# Altium schematic sheet SD.SchDoc
size A; SheetNumber: 10; SheetTotal: 10
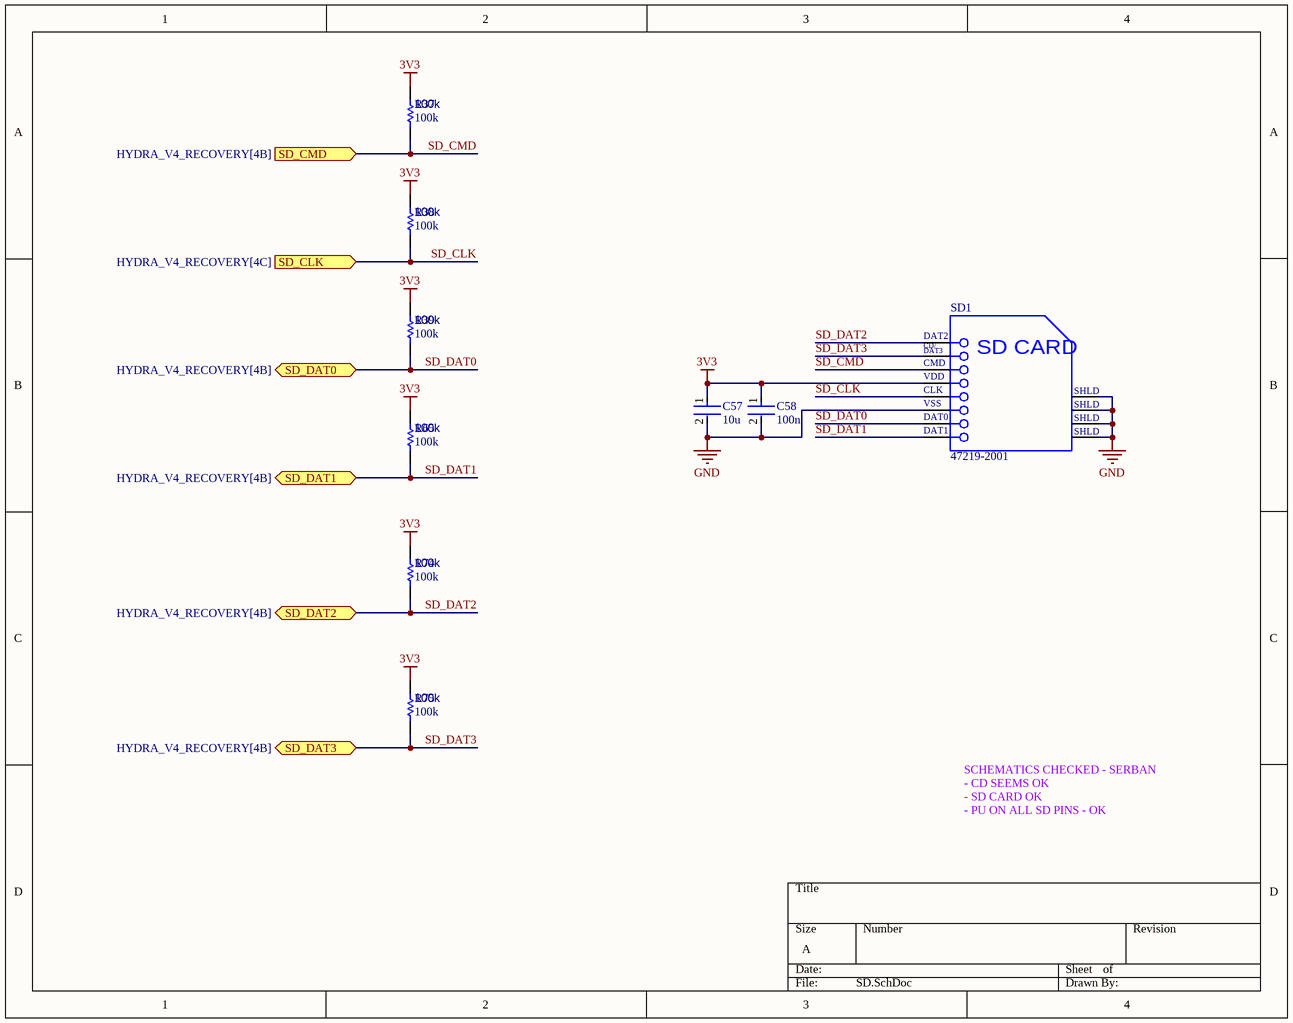
[diagram p0: SD.SchDoc]

## Parts
C57  10u  [FP-0402-L_1_0_0_05-W_0_5-IPC_A]
C58  100n  [FP-0402-L_1_0_0_05-W_0_5-IPC_A]
R37  100k  [R0603B]
R38  100k  [R0603B]
R39  100k  [R0603B]
R65  100k  [R0603B]
R74  100k  [R0603B]
R75  100k  [R0603B]
SD1  47219-2001  [MOLX-47219-2001-8_V]

## Ports
SD_CLK (in, see HYDRA_V4_RECOVERY[4C]), SD_CMD (in, see HYDRA_V4_RECOVERY[4B]), SD_DAT0 (bidir, see HYDRA_V4_RECOVERY[4B]), SD_DAT1 (bidir, see HYDRA_V4_RECOVERY[4B]), SD_DAT2 (bidir, see HYDRA_V4_RECOVERY[4B]), SD_DAT3 (bidir, see HYDRA_V4_RECOVERY[4B])

## Nets
3V3: C57.1 C58.1 R37.1 R38.1 R39.1 R65.1 R74.1 R75.1 SD1.4(VDD)
GND: C57.2 C58.2 SD1.6(VSS) SD1.9(SHLD) SD1.10(SHLD) SD1.11(SHLD) SD1.12(SHLD)
SD_CLK: R38.2 SD1.5(CLK) ; port SD_CLK
SD_CMD: R37.2 SD1.3(CMD) ; port SD_CMD
SD_DAT0: R39.2 SD1.7(DAT0) ; port SD_DAT0
SD_DAT1: R65.2 SD1.8(DAT1) ; port SD_DAT1
SD_DAT2: R74.2 SD1.1(DAT2) ; port SD_DAT2
SD_DAT3: R75.2 SD1.2(CD/DAT3) ; port SD_DAT3

## Notes on the sheet
- SCHEMATICS CHECKED - SERBAN
  - CD SEEMS OK
  - SD CARD OK
  - PU ON ALL SD PINS - OK
- (in symbol CMP-2000-05245-1) CD/; DAT3; SD CARD

## Library data of the parts
C57 C58 = CMP-001-00058-1: LARGE PADS, 0402 CAP, CHANGE COMMENT TO MATCH REAL P/N; Capacitor Type: Ceramic; Min Operating Temperature: -55°C; Mounting Technology: Surface Mount; Pins: 2; Case/Package: 0402; RoHS Compliant: Yes; Max Operating Temperature: 85°C
  C57: Value: 10u
  C58: Value: 100n
R37-R39 R65 R74 R75 = CMP-009-00002-14: Resistor; Value: 100k
SD1 = CMP-2000-05245-1: MicroSD Card Connector, Hinge Type, -40 to 85 degC, 8-Pin SMD, RoHS, Tape and Reel; Manufacturer: Molex; Current Rating: 500mA; Number of Contacts: 8; Pitch: 1.09mm; Insertion - Extraction Style: Hinged; Voltage Rating: 100VDC; Product: CardConnectors; Contact Material: CopperAlloy; Series: 47219; Packaging: Reel; Brand: Molex; Product Category: MemoryCardConnectors; Housing Material: Thermoplastic; Mounting Style: SMD/SMT; Termination Style: SMD; Datasheet Version: Rev. F, 06/2009; Card Type: microSD; Manufacturer URL: http://www.molex.com/; RoHS: Details; Datasheet URL: http://www.molex.com/pdm_docs/sd/472192001_sd.pdf; Factory Pack Quantity: 2400